# EAGLE design USDA_Project (EAGLE 9.6.2)
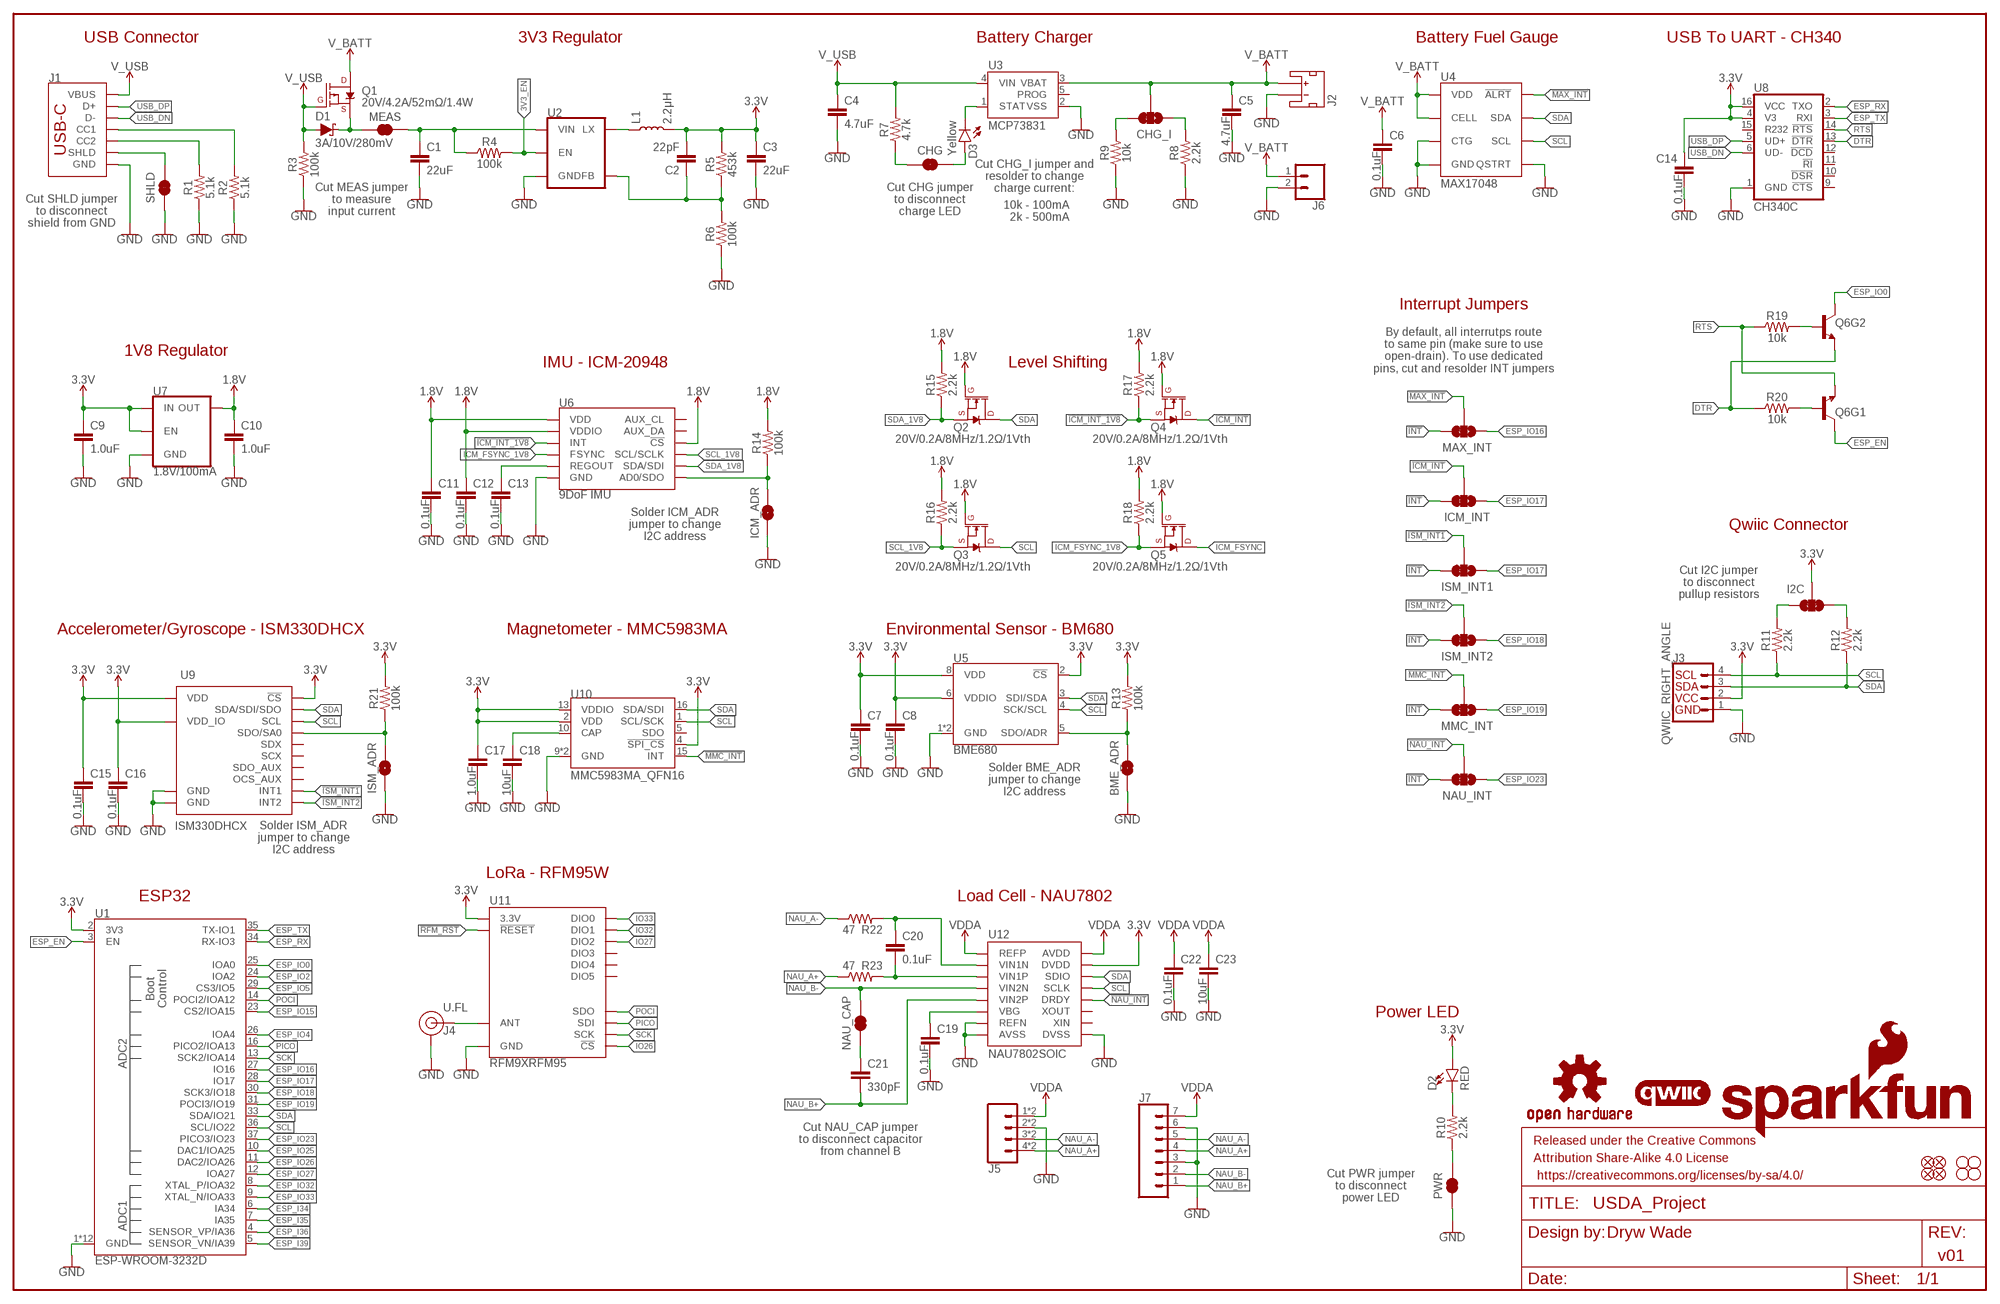
[diagram p0: schematic, sheet 1]

## Parts
BME_ADR  JUMPER-SMT_2_NO_SILK  [SMT-JUMPER_2_NO_SILK]
C1  22uF  22UF-0805-16V-20%  [0805]
C2  22pF  22PF-0603-50V-5%  [0603]
C3  22uF  22UF-0805-16V-20%  [0805]
C4  4.7uF  4.7UF-0603-6.3V-(10%)  [0603]
C5  4.7uF  4.7UF-0603-6.3V-(10%)  [0603]
C6  0.1uF  0.1UF-0603-25V-(+80/-20%)  [0603]
C7  0.1uF  0.1UF-0603-25V-(+80/-20%)  [0603]
C8  0.1uF  0.1UF-0603-25V-(+80/-20%)  [0603]
C9  1.0uF  1.0UF-0603-16V-10%  [0603]
C10  1.0uF  1.0UF-0603-16V-10%  [0603]
C11  0.1uF  0.1UF-0603-25V-(+80/-20%)  [0603]
C12  0.1uF  0.1UF-0603-25V-(+80/-20%)  [0603]
C13  0.1uF  0.1UF-0603-25V-(+80/-20%)  [0603]
C14  0.1uF  0.1UF-0603-25V-(+80/-20%)  [0603]
C15  0.1uF  0.1UF-0603-25V-(+80/-20%)  [0603]
C16  0.1uF  0.1UF-0603-25V-(+80/-20%)  [0603]
C17  1.0uF  1.0UF-0603-16V-10%  [0603]
C18  10uF  10UF-0603-6.3V-20%  [0603]
C19  0.1uF  0.1UF-0603-25V-(+80/-20%)  [0603]
C20  0.1uF  0.1UF-0603-25V-(+80/-20%)  [0603]
C21  330pF  330PF-0603-50V-5%  [0603]
C22  0.1uF  0.1UF-0603-25V-(+80/-20%)  [0603]
C23  10uF  10UF-0603-6.3V-20%  [0603]
CHG  JUMPER-SMT_2_NC_TRACE_SILK  [SMT-JUMPER_2_NC_TRACE_SILK]
CHG_I  JUMPER-SMT_3_1-NC_TRACE_SILK  [SMT-JUMPER_3_1-NC_TRACE_SILK]
D1  3A/10V/280mV  DIODE-SCHOTTKY-BAT60A  [SOD-323]
D2  RED  LED-RED0603  [LED-0603]
D3  Yellow  LED-YELLOW0603  [LED-0603]
FD1  FIDUCIAL1X2  [FIDUCIAL-1X2]
FD2  FIDUCIAL1X2  [FIDUCIAL-1X2]
FD3  FIDUCIAL1X2  [FIDUCIAL-1X2]
FD4  FIDUCIAL1X2  [FIDUCIAL-1X2]
FRAME1  FRAME-LEDGER  [CREATIVE_COMMONS]
H1  STAND-OFF  [STAND-OFF]
H2  STAND-OFF  [STAND-OFF]
H3  STAND-OFF  [STAND-OFF]
H4  STAND-OFF  [STAND-OFF]
I2C  JUMPER-SMT_3_2-NC_TRACE_SILK  [SMT-JUMPER_3_2-NC_TRACE_SILK]
ICM_ADR  JUMPER-SMT_2_NO_SILK  [SMT-JUMPER_2_NO_SILK]
ICM_INT  JUMPER-SMT_3_1-NC_TRACE_SILK  [SMT-JUMPER_3_1-NC_TRACE_SILK]
ISM_ADR  JUMPER-SMT_2_NO_SILK  [SMT-JUMPER_2_NO_SILK]
ISM_INT1  JUMPER-SMT_3_1-NC_TRACE_SILK  [SMT-JUMPER_3_1-NC_TRACE_SILK]
ISM_INT2  JUMPER-SMT_3_1-NC_TRACE_SILK  [SMT-JUMPER_3_1-NC_TRACE_SILK]
J1  USB_C_2-LAYER_PADS  [USB-C-16P-2LAYER-PADS]
J2  JST_2MM_MALE  [JST-2-SMD]
J3  QWIIC_RIGHT_ANGLE  QWIIC_CONNECTORJS-1MM  [JST04_1MM_RA]
J4  U.FL  U.FL2PIN  [U.FL]
J5  CONN_04SPRING  [1X04_SPRING_TERMINAL]
J6  CONN_021X02_NO_SILK  [1X02_NO_SILK]
J7  CONN_07NO_SILK  [1X07_NO_SILK]
L1  2.2μH  2.2μH-4X4-2.2μH-3A-45MOHM  [INDUCTOR_4X4MM]
LOGO1  SFE_LOGO_NAME_FLAME.1_INCH  [SFE_LOGO_NAME_FLAME_.1]
LOGO2  OSHW-LOGOS  [OSHW-LOGO-S]
LOGO3  QWIIC_LOGO_5MM  [QWIIC_5MM]
MAX_INT  JUMPER-SMT_3_1-NC_TRACE_SILK  [SMT-JUMPER_3_1-NC_TRACE_SILK]
MEAS  JUMPER-COMBO_2_NC_TRACE  [COMBO-JUMPER_2_NC_TRACE]
MMC_INT  JUMPER-SMT_3_1-NC_TRACE_SILK  [SMT-JUMPER_3_1-NC_TRACE_SILK]
NAU_CAP  JUMPER-SMT_2_NC_TRACE_SILK  [SMT-JUMPER_2_NC_TRACE_SILK]
NAU_INT  JUMPER-SMT_3_1-NC_TRACE_SILK  [SMT-JUMPER_3_1-NC_TRACE_SILK]
PWR  JUMPER-SMT_2_NC_TRACE_SILK  [SMT-JUMPER_2_NC_TRACE_SILK]
Q1  20V/4.2A/52mΩ/1.4W  MOSFET_PCH-DMG2305UX-7  [SOT23-3]
Q2  20V/0.2A/8MHz/1.2Ω/1Vth  MOSFET-NCH-RE1C002UNTCL  [SOT-416FL]
Q3  20V/0.2A/8MHz/1.2Ω/1Vth  MOSFET-NCH-RE1C002UNTCL  [SOT-416FL]
Q4  20V/0.2A/8MHz/1.2Ω/1Vth  MOSFET-NCH-RE1C002UNTCL  [SOT-416FL]
Q5  20V/0.2A/8MHz/1.2Ω/1Vth  MOSFET-NCH-RE1C002UNTCL  [SOT-416FL]
Q6  TRANS_NPN_DUAL-MBT3904DW1T1  [SC70-6]
R1  5.1k  5.1KOHM5.1KOHM-0603-1/10W-1%  [0603]
R2  5.1k  5.1KOHM5.1KOHM-0603-1/10W-1%  [0603]
R3  100k  100KOHM-0603-1/10W-1%  [0603]
R4  100k  100KOHM-0603-1/10W-1%  [0603]
R5  453k  453KOHM-0603-1/10W-1%  [0603]
R6  100k  100KOHM-0603-1/10W-1%  [0603]
R7  4.7k  4.7KOHM-0603-1/10W-1%  [0603]
R8  2.2k  2.2KOHM-0603-1/10W-1%  [0603]
R9  10k  10KOHM-0603-1/10W-1%  [0603]
R10  2.2k  2.2KOHM-0603-1/10W-1%  [0603]
R11  2.2k  2.2KOHM-0603-1/10W-1%  [0603]
R12  2.2k  2.2KOHM-0603-1/10W-1%  [0603]
R13  100k  100KOHM-0603-1/10W-1%  [0603]
R14  100k  100KOHM-0603-1/10W-1%  [0603]
R15  2.2k  2.2KOHM-0603-1/10W-1%  [0603]
R16  2.2k  2.2KOHM-0603-1/10W-1%  [0603]
R17  2.2k  2.2KOHM-0603-1/10W-1%  [0603]
R18  2.2k  2.2KOHM-0603-1/10W-1%  [0603]
R19  10k  10KOHM-0603-1/10W-1%  [0603]
R20  10k  10KOHM-0603-1/10W-1%  [0603]
R21  100k  100KOHM-0603-1/10W-1%  [0603]
R22  47  47OHM-0603-1/10W-1%  [0603]
R23  47  47OHM-0603-1/10W-1%  [0603]
SHLD  JUMPER-SMT_2_NC_TRACE_SILK  [SMT-JUMPER_2_NC_TRACE_SILK]
U1  ESP-WROOM-3232D  [ESP-WROOM-32D]
U2  AP3429/A  [SOT23-5]
U3  MCP73831  [SOT23-5]
U4  MAX17048  MAX17048DFN8  [DFN-8]
U5  BME680  BME680-LGA  [LGA3.0X3.0]
U6  9DoF IMU  ICM-20948  [QFN24-3X3-ICM-20948]
U7  1.8V/100mA  V_REG_SP6214-1.8V  [SC70]
U8  CH340C  [SO016]
U9  ISM330DHCX  [LGA-14L]
U10  MMC5983MA_QFN16  [LGA-16-3X3MM-4X4PINS]
U11  RFM9XRFM95  [RFM95]
U12  NAU7802SOIC  [SO16]

## Nets
1.8V: C10.1 C11.1 C12.1 Q2.1(G) Q3.1(G) Q4.1(G) Q5.1(G) R14.2 R15.2 R16.2 R17.2 R18.2 U6.8(VDDIO) U6.13(VDD) U6.22(!CS) U7.5(OUT)
3.3V: C2.2 C3.1 C7.1 C8.1 C9.1 C14.1 C15.1 C16.1 C17.1 D2.A I2C.2 J3.2 L1.P$2 R5.2 R13.2 R21.2 U1.2(3V3) U5.2(!CS) U5.6(VDDIO) U5.8(VDD) U7.1(IN) U7.3(EN) U8.4(V3) U8.16(VCC) U9.P5(VDD_IO) U9.P8(VDD) U9.P12(!CS!) U10.2(VDD) U10.4(!SPI_CS!) U10.13(VDDIO) U11.3.3V U12.15(DVDD)
3V3_EN: R4.2 U2.1(EN)
!ICM_INT!: ICM_INT.2 Q4.3(D)
!ICM_INT_1V8!: Q4.2(S) R17.1 U6.12(INT)
!INT!: ICM_INT.3 ISM_INT1.3 ISM_INT2.3 MAX_INT.3 MMC_INT.3 NAU_INT.3
!ISM_INT1!: ISM_INT1.2 U9.P4(INT1)
!ISM_INT2!: ISM_INT2.2 U9.P9(INT2)
!MAX_INT!: MAX_INT.2 U4.5(!ALRT)
!MMC_INT!: MMC_INT.2 U10.15(INT)
!NAU_INT!: NAU_INT.2 U12.12(DRDY)
!RFM_RST!: U11.!RESET
DTR: Q6.1(E) R20.1 U8.13(!DTR)
ESP_EN: Q6.3(C) U1.3(EN)
ESP_I34: U1.6(IA34)
ESP_I35: U1.7(IA35)
ESP_I36: U1.4(SENSOR_VP/IA36)
ESP_I39: U1.5(SENSOR_VN/IA39)
ESP_IO0: Q6.6(C) U1.25(IOA0)
ESP_IO2: U1.24(IOA2)
ESP_IO4: U1.26(IOA4)
ESP_IO5: U1.29(CS3/IO5)
ESP_IO15: U1.23(CS2/IOA15)
ESP_IO16: MAX_INT.1 U1.27(IO16)
ESP_IO17: ICM_INT.1 ISM_INT1.1 U1.28(IO17)
ESP_IO18: ISM_INT2.1 U1.30(SCK3/IO18)
ESP_IO19: MMC_INT.1 U1.31(POCI3/IO19)
ESP_IO23: NAU_INT.1 U1.37(PICO3/IO23)
ESP_IO25: U1.10(DAC1/IOA25)
ESP_IO26: U1.11(DAC2/IOA26)
ESP_IO27: U1.12(IOA27)
ESP_IO32: U1.8(XTAL_P/IOA32)
ESP_IO33: U1.9(XTAL_N/IOA33)
ESP_RX: U1.34(RX-IO3) U8.2(TXO)
ESP_TX: U1.35(TX-IO1) U8.3(RXI)
GND: BME_ADR.1 C1.2 C3.2 C4.2 C5.2 C6.2 C7.2 C8.2 C9.2 C10.2 C11.2 C12.2 C13.2 C14.2 C15.2 C16.2 C17.2 C18.2 C19.2 C22.2 C23.2 ICM_ADR.1 ISM_ADR.1 J1.GND J1.GND2(GND) J2.1(-) J3.1 J4.1(GND) J4.2(GND) J5.2 J5.6 J6.2 J7.3 J7.6 PWR.1 R1.1 R2.1 R3.1 R6.1 R8.1 R9.1 SHLD.1 U1.1(GND) U1.15(GND) U1.38(GND) U1.GND U1.GNDT1(GND) U1.GNDT2(GND) U1.GNDT3(GND) U1.GNDT4(GND) U1.GNDT5(GND) U1.GNDT6(GND) U1.GNDT7(GND) U1.GNDT8(GND) U2.2(GND) U3.2(VSS) U4.1(CTG) U4.4(GND) U4.6(QSTRT) U4.9(GND) U5.1(GND) U5.7(GND) U6.18(GND) U6.20(GND) U7.2(GND) U8.1(GND) U9.P6(GND) U9.P7(GND) U10.9(GND) U10.11(GND) U11.GND@1(GND) U11.GND@2(GND) U11.GND@3(GND) U12.7(REFN) U12.8(AVSS) U12.9(DVSS)
ICM_FSYNC: Q5.3(D)
ICM_FSYNC_1V8: Q5.2(S) R18.1 U6.11(FSYNC)
IO26: U11.NSS(!CS!)
IO27: U11.DIO2
IO32: U11.DIO1
IO33: U11.DIO0
N$1: J1.SHLD1(SHLD) J1.SHLD2(SHLD) J1.SHLD3(SHLD) J1.SHLD4(SHLD) SHLD.2
N$2: L1.P$1 U2.3(LX)
N$3: C1.1 MEAS.2 MEAS.4 R4.1 U2.4(VIN)
N$4: J1.B5(CC2) R1.2
N$5: J1.A5(CC1) R2.2
N$6: D1.C MEAS.1 MEAS.3 Q1.2(S)
N$7: C2.1 R5.1 R6.2 U2.5(FB)
N$8: D3.C U3.1(STAT)
N$9: CHG.2 D3.A
N$10: CHG.1 R7.1
N$11: CHG_I.3 R9.2
N$12: CHG_I.1 R8.2
N$13: BME_ADR.2 R13.1 U5.5(SDO/ADR)
N$14: C13.1 U6.10(REGOUT)
N$15: I2C.1 R12.2
N$16: I2C.3 R11.2
N$17: ICM_ADR.2 R14.1 U6.9(AD0/SDO)
N$18: Q6.5(B) R20.2
N$19: Q6.2(B) R19.2
N$20: C18.1 U10.10(CAP)
N$21: ISM_ADR.2 R21.1 U9.P1(SDO/SA0)
N$22: C19.1 U12.6(VBG)
N$23: D2.C R10.2
N$24: C21.1 NAU_CAP.1
N$25: J4.FEED(SIGNAL) U11.ANT
N$26: PWR.2 R10.1
N$27: C20.2 R23.2 U12.3(VIN1P)
N$28: C20.1 R22.2 U12.2(VIN1N)
NAU_A+: J5.4 J5.8 J7.4 R23.1
NAU_A-: J5.3 J5.7 J7.5 R22.1
NAU_B+: C21.2 J7.1 U12.5(VIN2P)
NAU_B-: J7.2 NAU_CAP.2 U12.4(VIN2N)
PICO: U1.16(PICO2/IOA13) U11.SDI
POCI: U1.14(POCI2/IOA12) U11.SDO
RTS: Q6.4(E) R19.1 U8.14(!RTS)
SCK: U1.13(SCK2/IOA14) U11.SCK
SCL: J3.4 Q3.3(D) R11.1 U1.36(SCL/IO22) U4.7(SCL) U5.4(SCK/SCL) U9.P13(SCL) U10.1(SCL/SCK) U12.13(SCLK)
SCL_1V8: Q3.2(S) R16.1 U6.23(SCL/SCLK)
SDA: J3.3 Q2.3(D) R12.1 U1.33(SDA/IO21) U4.8(SDA) U5.3(SDI/SDA) U9.P14(SDA/SDI/SDO) U10.16(SDA/SDI) U12.14(SDIO)
SDA_1V8: Q2.2(S) R15.1 U6.24(SDA/SDI)
USB_DN: J1.A7(D-) J1.B7(D-) U8.6(UD-)
USB_DP: J1.A6(D+) J1.B6(D+) U8.5(UD+)
V_BATT: C5.1 C6.1 CHG_I.2 J2.2(+) J6.1 Q1.3(D) U3.3(VBAT) U4.2(CELL) U4.3(VDD)
V_USB: C4.1 D1.A J1.VBUS1(VBUS) J1.VBUS2(VBUS) Q1.1(G) R3.2 R7.2 U3.4(VIN)
VDDA: C22.1 C23.1 J5.1 J5.5 J7.7 U12.1(REFP) U12.16(AVDD)
Unconnected: J2.NC1(PAD1) J2.NC2(PAD2) U3.5(PROG) U6.7(AUX_CL) U6.21(AUX_DA) U8.9(!CTS) U8.10(!DSR) U8.11(!RI) U8.12(!DCD) U8.15(R232) U9.P2(SDX) U9.P3(SCX) U9.P10(OCS_AUX) U9.P11(SDO_AUX) U10.5(SDO) U11.DIO3 U11.DIO4 U11.DIO5 U12.10(XIN) U12.11(XOUT)

## Notes on the sheet
- USB Connector | 3V3 Regulator | Battery Charger | Battery Fuel Gauge | USB To UART - CH340
- Cut CHG_I jumper and
  resolder to change
  charge current:
- Cut MEAS jumper
  to measure
  input current
- Cut CHG jumper
  to disconnect
  charge LED
- Cut SHLD jumper
  to disconnect
  shield from GND
- 10k - 100mA
  2k - 500mA
- Interrupt Jumpers
- 1V8 Regulator
- By default, all interrutps route
  to same pin (make sure to use
  open-drain). To use dedicated
  pins, cut and resolder INT jumpers
- IMU - ICM-20948 | Level Shifting
- Solder ICM_ADR
  jumper to change
  I2C address
- Qwiic Connector
- Cut I2C jumper
  to disconnect
  pullup resistors
- Accelerometer/Gyroscope - ISM330DHCX | Magnetometer - MMC5983MA | Environmental Sensor - BM680
- Solder BME_ADR
  jumper to change
  I2C address
- Solder ISM_ADR
  jumper to change
  I2C address
- LoRa - RFM95W
- ESP32 | Load Cell - NAU7802
- Power LED
- Cut NAU_CAP jumper
  to disconnect capacitor
  from channel B
- Cut PWR jumper
  to disconnect
  power LED
- Dryw Wade
- v01

## Library data of the parts
BME_ADR ICM_ADR ISM_ADR = SparkFun-Jumpers:JUMPER-SMT_2_NO: Normally open jumper This jumper has two pads in close proximity to each other. Apply solder to close the connection. Round pads are easier to solder for beginners, but are a lot larger. SparkFun Product that uses the round pads: SparkFun EL Sequencer <https://www.sparkfun.com/products/12781>
C1 C3 = SparkFun-Capacitors:22UF: 22µF ceramic capacitors A capacitor is a passive two-terminal electrical component used to store electrical energy temporarily in an electric field.; PROD_ID: CAP-14260
C2 = SparkFun-Capacitors:22PF: 22pF ceramic capacitors A capacitor is a passive two-terminal electrical component used to store electrical energy temporarily in an electric field.; PROD_ID: CAP-07876
C4 C5 = SparkFun-Capacitors:4.7UF: 4.7µF ceramic capacitors A capacitor is a passive two-terminal electrical component used to store electrical energy temporarily in an electric field.; PROD_ID: CAP-08280
C6-C8 C11-C16 C19 C20 C22 = SparkFun-Capacitors:0.1UF: 0.1µF ceramic capacitors A capacitor is a passive two-terminal electrical component used to store electrical energy temporarily in an electric field.; PROD_ID: CAP-00810
C9 C10 C17 = SparkFun-Capacitors:1.0UF: 1µF ceramic capacitors A capacitor is a passive two-terminal electrical component used to store electrical energy temporarily in an electric field.; PROD_ID: CAP-00868
C18 C23 = SparkFun-Capacitors:10UF: 10.0µF ceramic capacitors A capacitor is a passive two-terminal electrical component used to store electrical energy temporarily in an electric field.; PROD_ID: CAP-11015
C21 = SparkFun-Capacitors:330PF: 330pF/0.33nF ceramic capacitors A capacitor is a passive two-terminal electrical component used to store electrical energy temporarily in an electric field.; PROD_ID: CAP-10108
CHG NAU_CAP PWR SHLD = SparkFun-Jumpers:JUMPER-SMT_2_NC_TRACE: Normally closed trace jumper This jumper has a trace between two pads so it's normally closed (NC). Use a razor knife to open the connection. For best results follow the IPC guidelines for cutting traces: Cutout at least 0.063 mm (0.005 in). Remove all loose material to clean up the cut area. Seal the cut with an approved epoxy. Reapply solder to reclose the connection.
CHG_I ICM_INT ISM_INT1 ISM_INT2 MAX_INT MMC_INT NAU_INT = SparkFun-Jumpers:JUMPER-SMT_3_1-NC_TRACE: Normally closed trace jumper (1 of 2 connections) This jumper has a trace between two pads so it's normally closed (NC). The other connection is normally open (NO). Use a razor knife to open the connection. For best results follow the IPC guidelines for cutting traces: Cutout at least 0.063 mm (0.005 in). Remove all loose material to clean up the cut area. Seal the cut with an approved epoxy. Reapply solder to reclose the connection, or to close the NO connection.
D1 = SparkFun-DiscreteSemi:DIODE-SCHOTTKY: Schottky diode A Schottky diode is a semiconductor diode which has a low forward voltage drop and a very fast switching action.; PROD_ID: DIO-14072
D2 = SparkFun-LED:LED-RED: Red SMD LED Used in manufacturing of most products at SparkFun Packages: 0603 - SMD 0603 package [Product Link] <http://docs.avagotech.com/docs/AV02-0551EN> 0603 SMART - SMD 0603 SMART package ( more efficient and expensive)[Product Link] <http://www.osram-os.com/Graphics/XPic2/00077099_0.pdf> 1206 - SMD1206 package [Product Link] <https://www.sparkfun.com/datasheets/DevTools/LilyPad/Q150OVS4.pdff> SparkFun Products: Pro Mini 328 -5V <https://www.sparkfun.com/products/821> RedBoard <https://www.sparkfun.com/products/12757> IOIO-OTG <https://www.sparkfun.com/products/13613>; PROD_ID: DIO-00819
D3 = SparkFun-LED:LED-YELLOW: Yellow SMD LED Used in manufacturing several products at SparkFun. Packages: 0603 - SMD 0603 package[Product Link] <http://www.kingbrightusa.com/product.asp?catalog_name=LED&product_id=APT1608SYCK> 0603 -SMART - SMART SMD 0603 package (more efficient/more expensive) [Product Link] <http://www.osram-os.com/osram_os/en/products/product-catalog/led-light-emitting-diodes/smartled-0603/ly-l29k/index.jsp> LilyPad - SMD1206 package[Product Datasheet] <https://www.sparkfun.com/datasheets/DevTools/LilyPad/Q150YUS4.pdf> SparkFun Products: Blynk Board <https://www.sparkfun.com/products/13794> IOIO-OTG <https://www.sparkfun.com/products/13613> XBee Explorer Serial <https://www.sparkfun.com/products/13225>; PROD_ID: DIO-09003
FD1-FD4 = SparkFun-Aesthetics:FIDUCIAL: Fiducial Alignment Points Point-of-reference for pick-and-place machines and other optical instruments.
FRAME1 = SparkFun-Aesthetics:FRAME-LEDGER: Schematic Frame - Ledger Standard 11x14 US Ledger frame
H1-H4 = SparkFun-Hardware:STAND-OFF: Stand Off Drill holes for mechanically mounting via screws, standoffs, etc. Note: Use the keepout ring to avoid running the screw head into surrounding components. Variant Overviews STAND-OFF - Mechanical footprint for a #4 phillips button head screw. STAND-OFF-TIGHT - Mechanical footprint for a #4 phillips button head screw, Example SparkFun Products Screw - Phillips Head (1/4", 4-40, 10 pack) <https://www.sparkfun.com/products/10453> (PRT-10453) Screw - Phillips Head (1/2", 4-40, 10 pack) <https://www.sparkfun.com/products/10452> (PRT-10452) Screw - Phillips Head (3/4", 4-40, 10 pack) <https://www.sparkfun.com/products/10451> (PRT-10451) Screw - Phillips Head (1", 4-40, 10 pack) <https://www.sparkfun.com/products/10450> (PRT-10450)
I2C = SparkFun-Jumpers:JUMPER-SMT_3_2-NC_TRACE: Normally closed trace jumper (2 of 2 connections) This jumper has a trace between all three pads so they are normally closed (NC). Use a razor knife to open the connection(s). For best results follow the IPC guidelines for cutting traces: Cutout at least 0.063 mm (0.005 in). Remove all loose material to clean up the cut area. Seal the cut with an approved epoxy. Reapply solder to reclose the connection(s).
J1 = SparkFun-Connectors:USB_C: USB Type C 16Pin Connector Super Speed pins not available on the 16-pin purely SMD connector so this part is best for USB 2.0 implementations. D1 and D2 are tied together enabling D+/- no matter which way the cable is plugged into the connector. The two channel configuration pins (CC1/2) are exposed. These are normally connected to ground via 5.1k resistors but can be reconfigured for high current/high power applications. **4-LAYER BOARD WARNING!!** If designing 4-layer board, make sure to select the variant _4-LAYER-ISOLATED. The linked footprint (USB-C-16-4LAYER-ISOLATED) includes some very necessary cutout polygons in the inner layers (2 and 15). This prevents the PTH mounting shield legs on the USB connector from electrically connecting any other polygons on the inner layers (usually VCC and GND).; PROD_ID: CONN-14122
J2 = SparkFun-Connectors:JST_2MM_MALE: JST 2MM MALE RA CONNECTOR Two pin, compact surface mount connector. Commonly used as a battery input connection point. We really like the solid locking feeling and high current rating on these small connectors. We use these all the time as battery connectors. Mates to single-cell LiPo batteries. Here is the connector we sell at SparkFun: JST Right Angle Connector - White <https://www.sparkfun.com/products/8612> (PRT-08612) Datasheet <http://www.sparkfun.com/datasheets/Prototyping/Connectors/JST-Horizontal.pdf> It was used on these SparkFun products: SparkFun MOSFET Power Controller <https://www.sparkfun.com/products/11214> (PRT-11214) SparkFun Battery Babysitter - LiPo Battery Manager <https://www.sparkfun.com/products/13777> (PRT-13777) And many, many others that required a lipo battery connection.; PROD_ID: CONN-11443; SF_ID: PRT-08612
J3 = SparkFun-Connectors:QWIIC_CONNECTOR: SparkFun I2C Standard Qwiic Connector An SMD 1mm pitch JST connector makes it easy and quick (get it? Qwiic?) to connect I2C devices to each other. The Qwiic system <http://www.sparkfun.com/qwiic> enables fast and solderless connection between popular platforms and various sensors and actuators. We carry 200mm <https://www.sparkfun.com/products/14204>, 100mm <https://www.sparkfun.com/products/14205>, 50mm <https://www.sparkfun.com/products/14206>, and breadboard friendly <https://www.sparkfun.com/products/14207> Qwiic cables. We also offer 10 pcs strips <https://www.sparkfun.com/products/14323> the SMD connectors.; PROD_ID: CONN-13694
J4 = SparkFun-Connectors:U.FL2PIN: SMD Antenna Connector - U.FL 2mm height, 3.0mm x 3.0mm receptacle size. SparkFun Products: SparkFun WiFi Shield - ESP8266 <https://www.sparkfun.com/products/13287> SparkFun ESP8266 Thing <https://www.sparkfun.com/products/13231> SparkFun MiniGen - Pro Mini Signal Generator Shield <https://www.sparkfun.com/products/11420>; PROD_ID: CONN-09193; SF_ID: WRL-09144
J5 = SparkFun-Connectors:CONN_04: Multi connection point. Often used as Generic Header-pin footprint for 0.1 inch spaced/style header connections On any of the 0.1 inch spaced packages, you can populate with these: Break Away Headers - Straight <https://www.sparkfun.com/products/116> (PRT-00116) Break Away Male Headers - Right Angle <https://www.sparkfun.com/products/553> (PRT-00553) Female Headers <https://www.sparkfun.com/products/115> (PRT-00115) Break Away Headers - Machine Pin <https://www.sparkfun.com/products/117> (PRT-00117) Break Away Female Headers - Swiss Machine Pin <https://www.sparkfun.com/products/743> (PRT-00743) For SCREWTERMINALS and SPRING TERMINALS visit here: Screw Terimnals on SparkFun.com <https://www.sparkfun.com/search/results?term=Screw+Terminals> (5mm/3.5mm/2.54mm spacing) This device is also useful as a general connection point to wire up your design to another part of your project. Our various solder wires solder well into these plated through hole pads. Hook-Up Wire - Assortment (Stranded, 22 AWG) <https://www.sparkfun.com/products/11375> (PRT-11375) Hook-Up Wire - Assortment (Solid Core, 22 AWG) <https://www.sparkfun.com/products/11367> (PRT-11367) View the entire wire category on our website here <https://www.sparkfun.com/categories/141> Special notes: Molex polarized connector foot print use with SKU : PRT-08231 with associated crimp pins and housings. 1MM SMD Version SKU: PRT-10208; PROD_ID: CONN-14363; SF_ID: PRT-08075
J6 = SparkFun-Connectors:CONN_02: Multi connection point. Often used as Generic Header-pin footprint for 0.1 inch spaced/style header connections On any of the 0.1 inch spaced packages, you can populate with these: Break Away Headers - Straight <https://www.sparkfun.com/products/116> (PRT-00116) Break Away Male Headers - Right Angle <https://www.sparkfun.com/products/553> (PRT-00553) Female Headers <https://www.sparkfun.com/products/115> (PRT-00115) Break Away Headers - Machine Pin <https://www.sparkfun.com/products/117> (PRT-00117) Break Away Female Headers - Swiss Machine Pin <https://www.sparkfun.com/products/743> (PRT-00743) For SCREWTERMINALS and SPRING TERMINALS visit here: Screw Terimnals on SparkFun.com <https://www.sparkfun.com/search/results?term=Screw+Terminals> (5mm/3.5mm/2.54mm spacing) This device is also useful as a general connection point to wire up your design to another part of your project. Our various solder wires solder well into these plated through hole pads. Hook-Up Wire - Assortment (Stranded, 22 AWG) <https://www.sparkfun.com/products/11375> (PRT-11375) Hook-Up Wire - Assortment (Solid Core, 22 AWG) <https://www.sparkfun.com/products/11367> (PRT-11367) View the entire wire category on our website here <https://www.sparkfun.com/categories/141> Special notes: Molex polarized connector foot print use with: PRT-08233 with associated crimp pins and housings. 2.54_SCREWTERM for use with PRT-10571. 3.5mm Screw Terminal footprints for PRT-08084 5mm Screw Terminal footprints for use with PRT-08432
J7 = SparkFun-Connectors:CONN_07: Multi connection point. Often used as Generic Header-pin footprint for 0.1 inch spaced/style header connections On any of the 0.1 inch spaced packages, you can populate with these: Break Away Headers - Straight <https://www.sparkfun.com/products/116> (PRT-00116) Break Away Male Headers - Right Angle <https://www.sparkfun.com/products/553> (PRT-00553) Female Headers <https://www.sparkfun.com/products/115> (PRT-00115) Break Away Headers - Machine Pin <https://www.sparkfun.com/products/117> (PRT-00117) Break Away Female Headers - Swiss Machine Pin <https://www.sparkfun.com/products/743> (PRT-00743) For SCREWTERMINALS and SPRING TERMINALS visit here: Screw Terimnals on SparkFun.com <https://www.sparkfun.com/search/results?term=Screw+Terminals> (5mm/3.5mm/2.54mm spacing) This device is also useful as a general connection point to wire up your design to another part of your project. Our various solder wires solder well into these plated through hole pads. Hook-Up Wire - Assortment (Stranded, 22 AWG) <https://www.sparkfun.com/products/11375> (PRT-11375) Hook-Up Wire - Assortment (Solid Core, 22 AWG) <https://www.sparkfun.com/products/11367> (PRT-11367) View the entire wire category on our website here <https://www.sparkfun.com/categories/141> Special notes: Molex polarized connector foot print use with SKU : PRT-08231 with associated crimp pins and housings. 1MM SMD Version SKU: PRT-10208 NOTES ON THE VARIANTS LOCK and LOCK_LONGPADS... This footprint was designed to help hold the alignment of a through-hole component (i.e. 6-pin header) while soldering it into place. You may notice that each hole has been shifted either up or down by 0.005 of an inch from it's more standard position (which is a perfectly straight line). This slight alteration caused the pins (the squares in the middle) to touch the edges of the holes. Because they are alternating, it causes a "brace" to hold the component in place. 0.005 has proven to be the perfect amount of "off-center" position when using our standard breakaway headers. Although looks a little odd when you look at the bare footprint, once you have a header in there, the alteration is very hard to notice. Also,if you push a header all the way into place, it is covered up entirely on the bottom side.
L1 = SparkFun-Coils:2.2μH: 2.2μH Inductor Resist changes in electrical current. Basically a coil of wire. SparkFun Products: SparkFun Edge - HX711 <https://www.sparkfun.com/products/15170>; PROD_ID: NDUC-13770
LOGO1 = SparkFun-Aesthetics:SFE_LOGO_NAME_FLAME: SparkFun Font Logo w/ Flame This is the SparkFun full logo. The logo on the schematic will always be the same size; the package variant is the height of the flame part of the logo. Default layer for the logo on the board is tSilk.
LOGO2 = SparkFun-Aesthetics:OSHW-LOGO: Open-Source Hardware (OSHW) Logo This logo indicates the piece of hardware it is found on incorporates a OSHW license and/or adheres to the definition of open source hardware found here: http://freedomdefined.org/OSHW
LOGO3 = SparkFun-Aesthetics:QWIIC_LOGO: Qwiic Logos for placement on schematic and PCB. The 5.5mm silk logo is best for placing next to Qwiic connector.
MEAS = SparkFun-Jumpers:JUMPER-COMBO_2_NC_TRACE
Q1 = SparkFun-DiscreteSemi:MOSFET_PCH: P-channel MOSFETs Voltage controlled devices that allow control of high current outputs. SparkFun Products: SparkFun ESP32 Thing <https://www.sparkfun.com/products/13907> SparkFun ESP8266 Thing <https://www.sparkfun.com/products/13231> SparkFun Pi Servo HAT V2 <https://www.sparkfun.com/products/15316> DMG2305UX-7 (20V/4.2A/SOT23-3); PROD_ID: TRANS-14388
Q2-Q5 = SparkFun-DiscreteSemi:MOSFET-NCH: N-channel MOSFETs Voltage controlled devices that allow control of high current outputs. SparkFun Products: SparkFun OpenScale <https://www.sparkfun.com/products/13261> SparkFun Digital Sandbox <https://www.sparkfun.com/products/12651> SparkFun Monster Moto Shield <https://www.sparkfun.com/products/10182> SparkFun MOSFET Power Controller <https://www.sparkfun.com/products/11214>; PROD_ID: TRANS-14399
Q6 = SparkFun-DiscreteSemi:TRANS_NPN_DUAL: Dual NPN Transistors in Single Package The MBT3904W1 puts two general purpose 3904 NPN transistors in a single package. Datasheet <http://www.onsemi.com/pub_link/Collateral/MBT3904DW1T1-D.PDF> SparkFun Products: SparkFun ESP32 Thing <https://www.sparkfun.com/products/13907>; PROD_ID: TRANS-13337
R1 R2 = SparkFun-Resistors:5.1KOHM; PROD_ID: RES-12083
R3 R4 R6 R13 R14 R21 = SparkFun-Resistors:100KOHM: 100kΩ resistor A resistor is a passive two-terminal electrical component that implements electrical resistance as a circuit element. Resistors act to reduce current flow, and, at the same time, act to lower voltage levels within circuits. - Wikipedia; PROD_ID: RES-07828
R5 = SparkFun-Resistors:453KOHM: 453kΩ resistor A resistor is a passive two-terminal electrical component that implements electrical resistance as a circuit element. Resistors act to reduce current flow, and, at the same time, act to lower voltage levels within circuits. - Wikipedia; PROD_ID: RES-14466
R7 = SparkFun-Resistors:4.7KOHM: 4.7kΩ resistor A resistor is a passive two-terminal electrical component that implements electrical resistance as a circuit element. Resistors act to reduce current flow, and, at the same time, act to lower voltage levels within circuits. - Wikipedia; PROD_ID: RES-07857
R8 R10-R12 R15-R18 = SparkFun-Resistors:2.2KOHM: 2.2kΩ resistor A resistor is a passive two-terminal electrical component that implements electrical resistance as a circuit element. Resistors act to reduce current flow, and, at the same time, act to lower voltage levels within circuits. - Wikipedia; PROD_ID: RES-08272
R9 R19 R20 = SparkFun-Resistors:10KOHM: 10kΩ resistor A resistor is a passive two-terminal electrical component that implements electrical resistance as a circuit element. Resistors act to reduce current flow, and, at the same time, act to lower voltage levels within circuits. - Wikipedia; PROD_ID: RES-00824
R22 R23 = SparkFun-Resistors:47OHM: 47Ω resistor A resistor is a passive two-terminal electrical component that implements electrical resistance as a circuit element. Resistors act to reduce current flow, and, at the same time, act to lower voltage levels within circuits. - Wikipedia; PROD_ID: RES-14282
U1 = SparkFun-RF:ESP-WROOM-32: ESP-WROOM-32D - trace antenna (includes keepout) ESP-WROOM-32U - U.FL antenna connector Includes both "standard" footprints and "narrow" version (for use with tighter layouts).; PROD_ID: IC-15676
U2 = SparkFun-IC-Power:AP3429/A: AP3429A DC adjustable buck up to 2A output. Auto cut-off at 2.7V makes this a good option for LiPo and other battery powered circuits.; PROD_ID: IC-14465
U3 = SparkFun-IC-Power:MCP73831: MCP73831T Li-Ion, Li-Pol Controller Miniature single cell, fully integrated Li-Ion, Li-polymer charge management controller Datasheet <http://ww1.microchip.com/downloads/en/DeviceDoc/20001984g.pdf> SparkFun Products: SparkFun ESP32 Thing <https://www.sparkfun.com/products/13907> SparkFun 9DoF Razor IMU M0 <https://www.sparkfun.com/products/14001>; PROD_ID: IC-09995
U4 = SparkFun-IC-Power:MAX17048: Micropower 1-Cell Li+ ModelGauge SparkFun Products Qduino Mini <https://www.sparkfun.com/products/13614> (DEV-13614); PROD_ID: IC-12551
U5 = SparkFun-Sensors:BME680: Bosch BME680 – Combined Humidity and Pressure Sensor The BME680 is as combined digital humidity, pressure and temperature sensor based on proven sensing principles. The sensor module is housed in an extremely compact metal-lid LGA package with a footprint of only 3.0×3.0mm with a height of 0.93mm. Its small dimensions and its low power consumption allow the implementation in battery driven devices such as handsets, GPS modules or watches.; PROD_ID: IC-14656
U6 = SparkFun-Sensors:ICM-20948: ICM-20948 9 Degree of Freedom IMU World’s lowest power 9-axis MotionTracking device that is ideally suited for smartphones, tablets, wearable sensors, and IoT applications. Includes onboard Digital Motion Processor to offload computations from the host processor Datasheet <https://cdn.sparkfun.com/assets/learn_tutorials/5/5/0/MPU9250REV1.0.pdf> SparkFun Products: SparkFun IMU Breakout - ICM-20948 <https://www.sparkfun.com/products/15182>; PROD_ID: IC-14247
U7 = SparkFun-IC-Power:V_REG_SP6214: Voltage Regulator - SP6214 SP6214 Series SC-70-5 Micropower SC-70 100 mA CMOS LDO Regulator Datasheet <https://www.exar.com/content/document.ashx?id=654> SparkFun Products: MP3 Trigger <https://www.sparkfun.com/products/13720> SparkFun Particle Sensor Breakout <https://www.sparkfun.com/products/14045>; PROD_ID: VREG-08428
U8 = SparkFun-IC-Comms:CH340C; PROD_ID: IC-14038
U9 = SparkFun-Sensors:ISM330DHCX: ISM330DHCX 6DoF The ISM330DHCX is a system-in-package featuring a high-performance 3D digital accelerometer and 3D digital gyroscope tailored for Industry 4.0 applications.; PROD_ID: IC-16693
U10 = SparkFun-Sensors:MMC5983MA: High Performance 3-axis Magnetic Sensor The MMC5983MA is an AEC-Q100 qualified complete 3-axis magnetic sensor with on-chip signal processing and integrated I2C/SPI bus suitable for use in automotive applications. The device can be connected directly to a microprocessor, eliminating the need for A/D converters or timing resources. It can measure magnetic fields within the full scale range of ±8 Gauss (G), with 0.25mG/0.0625mG per LSB resolution at 16bits/18bits operation mode and 0.4 mG total RMS noise level, enabling heading accuracy of ±0.5° in electronic compass applications.; PROD_ID: IC-16314
U11 = SparkFun-RF:RFM9X: RFM95/96/97/98 The RFM95/96/97/98(W) transceivers feature the LoRaTM long range modem that provides ultra-long range spread spectrum communication and high interference immunity whilst minimising current consumption. These devices also support high performance (G)FSK modes for systems including WMBus, IEEE802.15.4g. The RFM95/96/97/98(W) deliver exceptional phase noise, selectivity, receiver linearity and IIP3 for significantly lower current consumption than competing devices Datasheet <http://www.hoperf.com/upload/rf/RFM95_96_97_98W.pdf>; PROD_ID: IC-13959
U12 = SparkFun-IC-Conversion:NAU7802: 24-bit load cell conversion IC with I2C interface in SOIC-16 package. Similar to HX711 but with true I2C interface.; PROD_ID: IC-14299

## Board
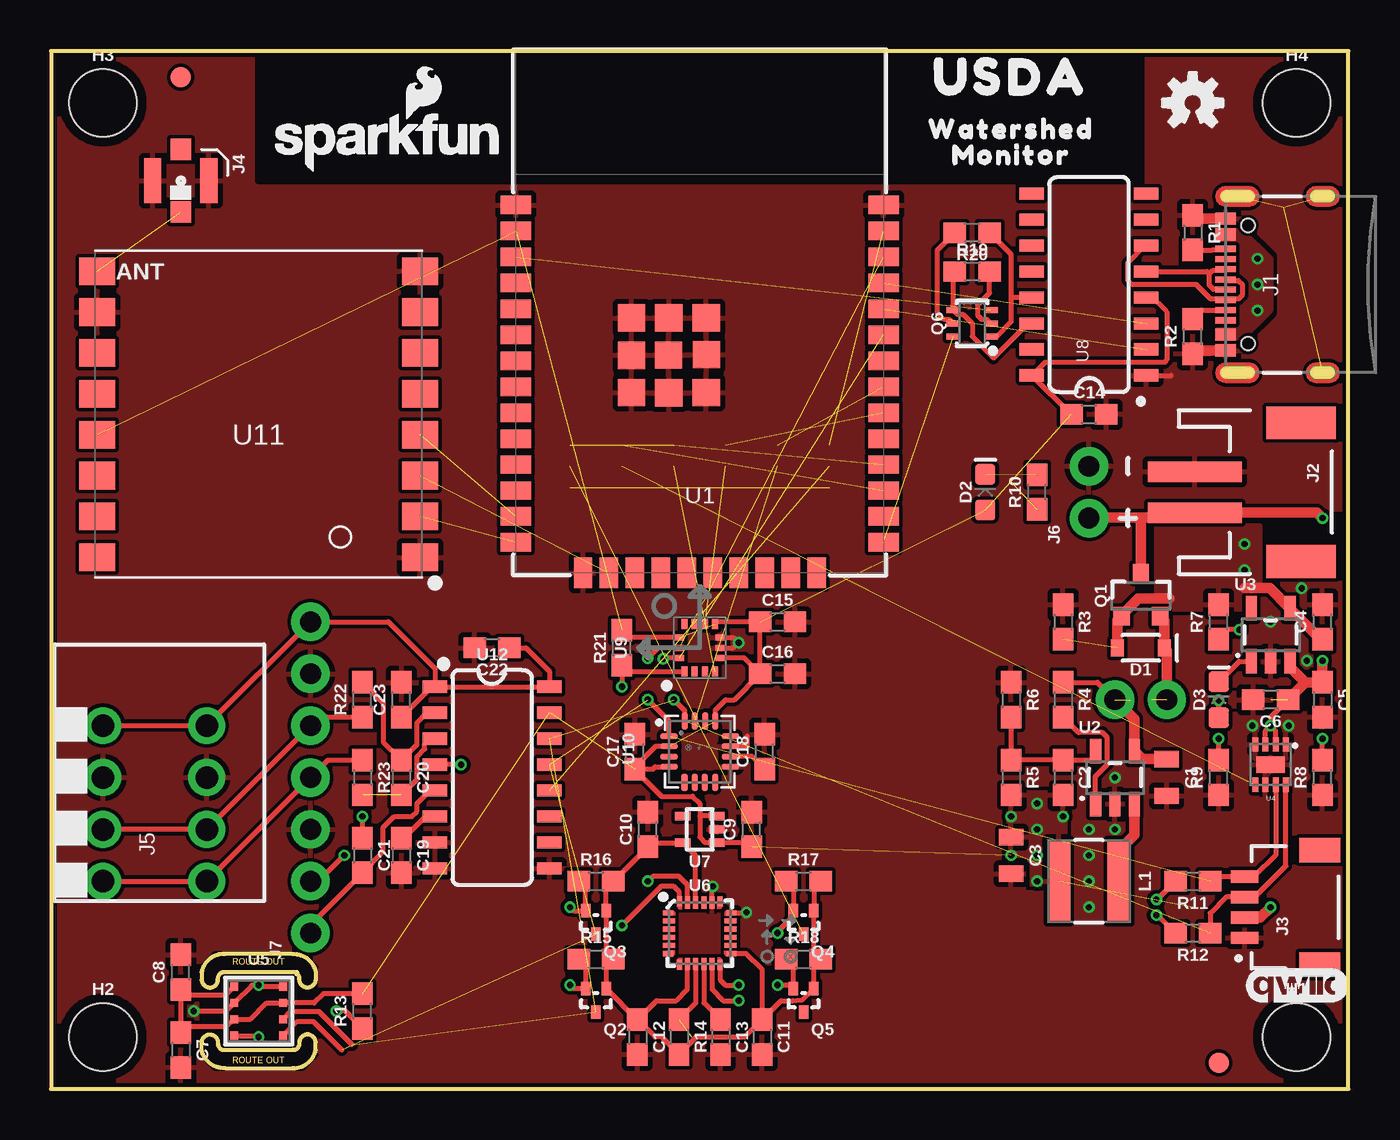
[diagram p1: board, top side]
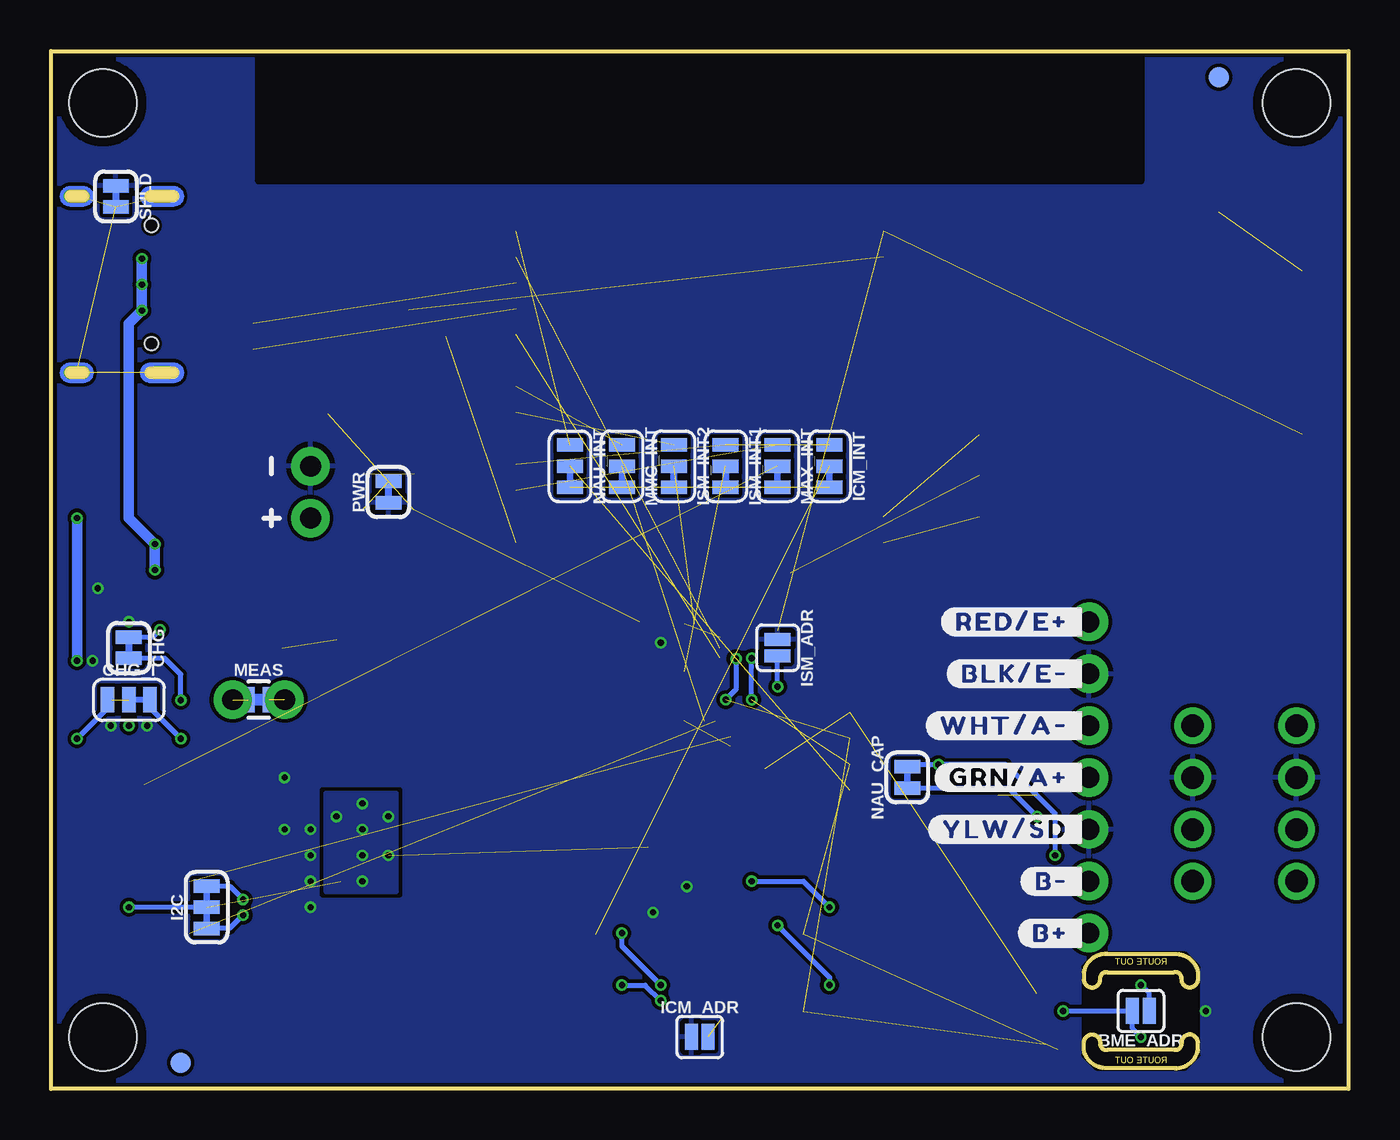
[diagram p2: board, bottom side, seen from below]

Size 63.5 x 50.8 mm. Coordinates in mm from the lower left corner, seen from the top.
Outline: 0,0 63.5,0 63.5,50.8 0,50.8 0,0
Copper layers (1*16): Top 0.035mm / dielectric 1.5mm / Bottom 0.035mm
Design rules "SparkFun-2-Layer-Minimum-JLCPCB": minimum track width 5mil, minimum drill 0.3mm, track to track 5mil, track to pad 5mil, pad to pad 5mil, via to via 5mil, smd to smd 5mil, copper to edge 7mil, drill to drill 7mil, minimum pad ring 5mil, minimum via ring 5mil, stop-mask expansion 2.5mil, vias tented up to drill 25mil, thermal gap 10mil
tRestrict: area 10.2,44.5 to 53.3,50.8; area 62.7,27.8 to 63.2,28.1
bRestrict: area 10.2,44.5 to 53.3,50.8
Milling: 44 lines

### Footprints (pad centres in the part's own frame; a part is rotated, then mirrored left to right if it is on the bottom)
SMT-JUMPER_2_NO_SILK = smd 0.635 x 1.27: 1 -0.406,0; 2 0.406,0
0805 = smd 0.8 x 1.2: 1 -0.9,0; 2 0.9,0
0603 = smd 1.1 x 1: 1 -0.85,0; 2 0.85,0
SMT-JUMPER_2_NC_TRACE_SILK = smd 0.66 x 1.27: 1 -0.521,0; 2 0.521,0
SMT-JUMPER_3_1-NC_TRACE_SILK = smd 0.66 x 1.27: 1 -1.041,0; 2 0,0; 3 1.041,0
SOD-323 = smd 0.63 x 0.83: A 1.15,0; C -1.15,0
LED-0603 = smd 1 x 1: A -0.877,0; C 0.877,0
FIDUCIAL-1X2 = smd 1 x 1: 1 0,0
STAND-OFF = hole 3.302: 0,0
SMT-JUMPER_3_2-NC_TRACE_SILK = smd 0.66 x 1.27: 1 -1.041,0; 2 0,0; 3 1.041,0
USB-C-16P-2LAYER-PADS = smd 0.3 x 1: A5 -1.25,-0.34; A6 -0.25,-0.34; A7 0.25,-0.34; A8 1.25,-0.34; B5 1.75,-0.34; B6 0.75,-0.34; B7 -0.75,-0.34; B8 -1.75,-0.34 | smd 0.6 x 1: GND -3.225,-0.34; GND2 3.225,-0.34; VBUS1 -2.45,-0.34; VBUS2 2.45,-0.34 | drill 0.4 pad 0.6 long: SHLD1 -4.318,-0.915; SHLD2 4.318,-0.915; SHLD3 -4.318,-5.095; SHLD4 4.318,-5.095 | hole 0.65: -2.89,-1.445; 2.89,-1.445
JST-2-SMD = smd 1 x 4.6: 1 -1,-3.7; 2 1,-3.7 | smd 1.6 x 3.4: NC1 -3.4,1.5; NC2 3.4,1.5
JST04_1MM_RA = smd 0.6 x 1.35: 1 -1.5,0; 2 -0.5,0; 3 0.5,0; 4 1.5,0 | smd 1.2 x 2: NC1 2.8,-3.675; NC2 -2.8,-3.675
U.FL = smd 2.2 x 0.85: 1 0,1.375; 2 0,-1.375 | smd 1.05 x 1: FEED 1.525,0; NC -1.525,0
1X04_SPRING_TERMINAL = drill 1.1 pad 1.8: 1 7.62,2.54; 2 5.08,2.54; 3 2.54,2.54; 4 0,2.54; 5 7.62,-2.54; 6 5.08,-2.54; 7 2.54,-2.54; 8 0,-2.54
1X02_NO_SILK = drill 1.016 pad 1.88: 1 0,0; 2 2.54,0
1X07_NO_SILK = drill 1.016 pad 1.88: 1 0,0; 2 2.54,0; 3 5.08,0; 4 7.62,0; 5 10.16,0; 6 12.7,0; 7 15.24,0
INDUCTOR_4X4MM = smd 4.089 x 1.143: P$1 0,1.473; P$2 0,-1.473
COMBO-JUMPER_2_NC_TRACE = smd 0.635 x 1.27: 1 -0.508,0; 2 0.508,0 | drill 1.016 pad 1.88: 3 -1.27,0; 4 1.27,0
SOT23-3 = smd 0.8 x 0.9: 1 -0.95,-1; 2 0.95,-1; 3 0,1.1
SOT-416FL = smd 0.46 x 0.65: 1 -0.5,-1.1; 2 0.5,-1.1; 3 0,0.05
SC70-6 = smd 0.3 x 0.66: 1 -0.65,-0.92; 2 0,-0.92; 3 0.65,-0.92; 4 0.65,0.92; 5 0,0.92; 6 -0.65,0.92
ESP-WROOM-32D = smd 0.9 x 1.5: 1 6.43,9; 2 5.16,9; 3 3.89,9; 4 2.62,9; 5 1.35,9; 6 0.08,9; 7 -1.19,9; 8 -2.46,9; 9 -3.73,9; 10 -5,9; 11 -6.27,9; 12 -7.54,9; 13 -8.81,9; 14 -10.08,9; 25 -10.08,-9; 26 -8.81,-9; 27 -7.54,-9; 28 -6.27,-9; 29 -5,-9; 30 -3.73,-9; 31 -2.46,-9; 32 -1.19,-9; 33 0.08,-9; 34 1.35,-9; 35 2.62,-9; 36 3.89,-9; 37 5.16,-9; 38 6.43,-9 | smd 1.5 x 0.9: 15 -11.57,5.715; 16 -11.57,4.445; 17 -11.57,3.175; 18 -11.57,1.905; 19 -11.57,0.635; 20 -11.57,-0.635; 21 -11.57,-1.905; 22 -11.57,-3.175; 23 -11.57,-4.445; 24 -11.57,-5.715 | smd 1.33 x 1.33: GND -0.912,1.531; GNDT1 -2.751,3.346; GNDT2 -2.761,1.516; GNDT3 -2.751,-0.314; GNDT4 -0.891,-0.324; GNDT5 0.909,-0.314; GNDT6 0.909,1.516; GNDT7 0.909,3.346; GNDT8 -0.921,3.346
SOT23-5 = smd 0.55 x 1.2: 1 -0.95,-1.3; 2 0,-1.3; 3 0.95,-1.3; 4 0.95,1.3; 5 -0.95,1.3
DFN-8 = smd 0.3 x 0.7: 1 -0.75,-0.99; 2 -0.25,-0.99; 3 0.25,-0.99; 4 0.75,-0.99; 5 0.75,0.99; 6 0.25,0.99; 7 -0.25,0.99; 8 -0.75,0.99 | smd 1.38 x 0.8: 9 0,0
LGA3.0X3.0 = smd 0.4 x 0.4: 1 1.2,1.2; 2 1.2,0.4; 3 1.2,-0.4; 4 1.2,-1.2; 5 -1.2,-1.2; 6 -1.2,-0.4; 7 -1.2,0.4; 8 -1.2,1.2
QFN24-3X3-ICM-20948 = smd 0.495 x 0.25: 1 -1.552,1; 6 -1.552,-1; 13 1.552,-1; 18 1.552,1 | smd 0.6 x 0.25: 2 -1.5,0.6; 3 -1.5,0.2; 4 -1.5,-0.2; 5 -1.5,-0.6; 14 1.5,-0.6; 15 1.5,-0.2; 16 1.5,0.2; 17 1.5,0.6 | smd 0.25 x 0.495: 7 -1,-1.552; 12 1,-1.552; 19 1,1.552; 24 -1,1.552 | smd 0.25 x 0.6: 8 -0.6,-1.5; 9 -0.2,-1.5; 10 0.2,-1.5; 11 0.6,-1.5; 20 0.6,1.5; 21 0.2,1.5; 22 -0.2,1.5; 23 -0.6,1.5
SC70 = smd 0.4 x 0.75: 1 -0.65,-0.825; 2 0,-0.825; 3 0.65,-0.825; 4 0.65,0.825; 5 -0.65,0.825
SO016 = smd 0.6 x 1.2: 1 -4.445,-2.8; 2 -3.175,-2.8; 3 -1.905,-2.8; 4 -0.635,-2.8; 5 0.635,-2.8; 6 1.905,-2.8; 7 3.175,-2.8; 8 4.445,-2.8; 9 4.445,2.8; 10 3.175,2.8; 11 1.905,2.8; 12 0.635,2.8; 13 -0.635,2.8; 14 -1.905,2.8; 15 -3.175,2.8; 16 -4.445,2.8
LGA-14L = smd 0.48 x 0.3: P1 -1.163,0.75; P2 -1.163,0.25; P3 -1.163,-0.25; P4 -1.163,-0.75; P8 1.163,-0.75; P9 1.163,-0.25; P10 1.163,0.25; P11 1.163,0.75 | smd 0.3 x 0.48: P5 -0.5,-1; P6 0,-1; P7 0.5,-1; P12 0.5,1; P13 0,1; P14 -0.5,1
LGA-16-3X3MM-4X4PINS = smd 0.3 x 0.85: 1 0.754,1.498; 2 0.254,1.498; 3 -0.246,1.498; 4 -0.746,1.498; 9 -0.746,-1.506; 10 -0.246,-1.506; 11 0.254,-1.506; 12 0.754,-1.506 | smd 0.85 x 0.3: 5 -1.508,0.746; 6 -1.508,0.246; 7 -1.508,-0.254; 8 -1.508,-0.754; 13 1.496,-0.764; 14 1.496,-0.264; 15 1.496,0.236; 16 1.496,0.736
RFM95 = smd 1.75 x 1.35: 3.3V 7.9,1; !RESET -7.9,-3; ANT 7.9,-7; DIO0 7.9,3; DIO1 7.9,5; DIO2 7.9,7; DIO3 7.9,-3; DIO4 7.9,-1; DIO5 -7.9,-5; GND@1 -7.9,7; GND@2 -7.9,-7; GND@3 7.9,-5; NSS -7.9,-1; SCK -7.9,1; SDI -7.9,3; SDO -7.9,5
SO16 = smd 0.6 x 1.2: 1 -4.445,-2.8; 2 -3.175,-2.8; 3 -1.905,-2.8; 4 -0.635,-2.8; 5 0.635,-2.8; 6 1.905,-2.8; 7 3.175,-2.8; 8 4.445,-2.8; 9 4.445,2.8; 10 3.175,2.8; 11 1.905,2.8; 12 0.635,2.8; 13 -0.635,2.8; 14 -1.905,2.8; 15 -3.175,2.8; 16 -4.445,2.8

### Placement (x,y rotation side)
BME_ADR  10.16,3.81 180 bottom
C1  54.61,15.24 270 top
C2  49.53,15.24 270 top
C3  46.99,11.43 270 top
C4  62.23,22.86 90 top
C5  62.23,19.05 270 top
C6  59.69,19.05 180 top
C7  6.35,1.91 270 top
C8  6.35,5.71 90 top
C9  34.29,12.7 90 top
C10  29.21,12.7 90 top
C11  34.8,2.54 270 top
C12  28.7,2.54 270 top
C13  32.77,2.54 270 top
C14  50.8,33.02 0 top
C15  35.56,22.86 0 top
C16  35.56,20.32 0 top
C17  28.57,16.51 90 top
C18  34.92,16.51 90 top
C19  17.14,11.43 270 top
C20  17.14,15.24 270 top
C21  15.24,11.43 270 top
C22  21.59,21.59 180 top
C23  17.14,19.05 90 top
CHG  59.69,21.59 270 bottom
CHG_I  59.69,19.05 0 bottom
D1  53.34,21.59 180 top
D2  45.72,29.21 90 top
D3  57.15,19.05 90 top
FD1  57.15,1.27 0 bottom
FD2  57.15,1.27 0 top
FD3  6.35,49.53 0 top
FD4  6.35,49.53 0 bottom
FRAME1  8.89,-15.24 0 top  (outside the outline)
H1  60.96,2.54 0 top
H2  2.54,2.54 0 top
H3  2.54,48.26 0 top
H4  60.96,48.26 0 top
I2C  55.88,8.89 90 bottom
ICM_ADR  31.75,2.54 0 bottom
ICM_INT  25.4,30.48 270 bottom
ISM_ADR  27.94,21.59 270 bottom
ISM_INT1  30.48,30.48 270 bottom
ISM_INT2  33.02,30.48 270 bottom
J1  57.15,39.37 90 top
J2  59.69,29.21 270 top
J3  58.42,8.89 90 top
J4  6.35,44.45 270 top
J5  5.08,10.16 90 top
J6  50.8,27.94 90 top
J7  12.7,7.62 90 top
L1  50.8,10.16 270 top
LOGO1  16.51,46.35 0 top
LOGO2  55.88,48.26 0 top
LOGO3  60.96,5.08 0 top
MAX_INT  27.94,30.48 270 bottom
MEAS  53.34,19.05 0 bottom
MMC_INT  35.56,30.48 270 bottom
NAU_CAP  21.59,15.24 90 bottom
NAU_INT  38.1,30.48 270 bottom
PWR  46.99,29.21 90 bottom
Q1  53.34,24.13 0 top
Q2  26.67,3.81 180 top
Q3  26.67,7.62 180 top
Q4  36.83,7.62 180 top
Q5  36.83,3.81 180 top
Q6  45.09,37.47 90 top
R1  55.88,41.91 270 top
R2  55.88,36.83 90 top
R3  49.53,22.86 270 top
R4  49.53,19.05 270 top
R5  46.99,15.24 270 top
R6  46.99,19.05 270 top
R7  57.15,22.86 90 top
R8  62.23,15.24 90 top
R9  57.15,15.24 90 top
R10  48.26,29.21 90 top
R11  55.88,10.16 180 top
R12  55.88,7.62 180 top
R13  15.24,3.81 90 top
R14  30.73,2.54 270 top
R15  26.67,6.35 0 top
R16  26.67,10.16 0 top
R17  36.83,10.16 0 top
R18  36.83,6.35 0 top
R19  45.09,40.01 0 top
R20  45.09,41.91 180 top
R21  27.94,21.59 90 top
R22  15.24,19.05 90 top
R23  15.24,15.24 270 top
SHLD  60.33,43.69 270 bottom
U1  31.75,36.83 90 top
U2  52.07,15.24 0 top
U3  59.69,22.23 0 top
U4  59.69,15.88 180 top
U5  10.16,3.81 0 top
U6  31.75,7.62 0 top
U7  31.75,12.7 90 top
U8  50.8,39.37 90 top
U9  31.75,21.59 90 top
U10  31.75,16.51 90 top
U11  10.16,33.02 180 top
U12  21.59,15.24 270 top
U$1  [USDA0]  46.99,49.53 0 top
U$2  [WATERSHED0]  46.99,46.99 0 top
U$3  [MONITOR0]  46.99,45.72 0 top
U$4  [#RED#E#_#0]  12.7,22.86 0 bottom
U$5  [#BLK#E#_#0]  12.7,20.32 0 bottom
U$6  [#WHT#A#_#0]  12.7,17.78 0 bottom
U$7  [#GRN#A#_#0]  12.7,15.24 0 bottom
U$8  [#YLW#SD_#0]  12.7,12.7 0 bottom
U$10  [#B#_#0]  12.7,7.62 0 bottom
U$11  [#B#_#1]  12.7,10.16 0 bottom

### Tracks (layer width: path | path; a pad name or v marks a point on that pad's centre or on a via)
1.8V
  Top 0.229: 36.32,4.32 36.49,4.32 36.5,4.33 36.75,4.33 Q5.1
  Top 0.254: Q5.1 37.33,6 R18.2 37.33,6.7 Q4.1 37.33,9.81 R17.2 | U6.22 31.55,11.43 U7.5 29.41,12.05 C10.1 R16.2 27.17,9.81 Q3.1 27.17,6.7 R15.2 27.17,6 Q2.1 C12.1 | U6.13 34.02,6.62 34.8,5.84 C11.1 | C12.1 29.55,2.54 29.88,2.54 R14.2 31.58,2.54 33.95,2.54 C11.1 | C11.1 35.73,4.32 36.32,4.32 | C12.1 29.63,4.32 30.61,4.32 31.15,4.86 U6.8
3.3V  (via drill 0.3)  (10 unrouted)
  Top 0.254: C14.1 49.91,33.02 U8.16 48.63,35.56 54.49,35.56 54.61,35.68 54.61,38.04 53.79,38.86 53.73,38.86 U8.4 | U5.8 8.52,4.57 6.64,4.57 C8.1 C7.1 6.62,3.03 8.58,3.03 U5.6 9.76,3.41 10.56,4.21 U5.2 12.88,4.21 13.33,4.66 R13.2 | C16.1 33.94,21.09 U9.P5 | U9.P8 32.61,22.86 C15.1 C16.1 | C9.1 34.09,12.05 U7.1 32.02,12.05 31.75,12.32 31.75,13.35 | U7.3 31.75,13.35 | C17.1 29.46,15.66 29.57,15.76 U10.4 | U10.2 29.59,16.76 28.57,15.75 C17.1 | U10.13 32.51,18.54 33.02,19.05 33.44,19.05 C16.1 | U9.P12 28.29,22.09 R21.2 | C17.1 28.57,15.62 29.87,14.32 31.4,14.32 31.75,13.97 31.75,13.35
  Top 0.508: J3.2 59.19,8.39 v59.69,8.89
  Bottom 0.254: I2C.2 v59.69,8.89
  other vias: 48.26,12.7 48.26,13.97 48.26,11.43 48.26,10.16 46.99,11.43 49.53,13.34 46.99,13.34
  pour Top (isolate 0.305): 46.86,14.48 46.86,11.43 47.88,11.43 47.88,10.03 49.66,10.03 49.66,14.48
  pour Bottom (isolate 0.178): 46.61,14.48 46.61,9.65 50.04,9.65 50.04,14.48
3V3_EN
  Top 0.254: U2.1 51.12,15.31 51.69,15.88 51.69,17.2 51.46,17.44 50.29,17.44 R4.2
!ICM_INT!  (1 unrouted)
!ICM_INT_1V8!  (via drill 0.3)
  Top 0.254: R17.1 36.33,9.81 Q4.2 36.33,8.47 35.56,7.7 v35.56,7.62 | U6.12 32.75,5.35 33.02,5.08 v33.66,5.08
  Bottom 0.254: v33.66,5.08 35.56,6.99 v35.56,7.62
!INT!  (5 unrouted)
!ISM_INT1!  (1 unrouted)
!ISM_INT2!  (1 unrouted)
!MAX_INT!  (1 unrouted)
!MMC_INT!  (1 unrouted)
!NAU_INT!  (1 unrouted)
DTR
  Top 0.254: R20.1 46.99,40.85 46.99,38.98 46.99,38.73 | Q6.1 46.26,36.81 46.99,37.55 46.99,38.73 | U8.13 46.99,38.73
ESP_EN  (1 unrouted)
ESP_IO0  (1 unrouted)
ESP_IO16  (1 unrouted)
ESP_IO17  (2 unrouted)
ESP_IO18  (1 unrouted)
ESP_IO19  (1 unrouted)
ESP_IO23  (1 unrouted)
ESP_RX  (1 unrouted)
ESP_TX  (1 unrouted)
GND  (via drill 0.3)
  Top 0.254: 53.55,34.92 U8.1 54.83,34.92 | 57.33,35.98 J1.GND | 57.33,42.76 J1.GND2 | U5.1 10.23,5.01 v10.16,5.08 9.83,5.08 U5.7 8.56,3.81 v6.99,3.81 | U6.20 32.35,9.87 v32.38,9.91 | U6.18 34.02,8.62 v34.04,8.64 | U10.11 34.08,16.76 34.08,17.27 | U9.P6 33.4,21.59 v33.66,21.84 33.41,22.09 U9.P7
  Top 0.508: J1.GND2 56.05,42.59 R1.1 | J1.GND 56.05,36.15 R2.1
  Bottom 0.254: BME_ADR.1 9.75,4.67 v10.16,5.08
  other vias: 52.07,15.24 50.8,10.16 50.8,11.43 50.8,8.89 50.8,12.7 52.07,12.7 61.21,24.51 59.69,22.86 61.47,20.95 58.8,17.78 60.58,17.78
  pour Top (isolate 0.178, rank 2): 0,0 63.5,0 63.5,50.8 0,50.8
  cutout Top (isolate 0.305): 12.95,5.97 12.32,6.6 8,6.6 7.37,5.97 7.37,1.65 8,1.02 12.32,1.02 12.95,1.65
  pour Bottom (isolate 0.178, rank 2): 63.5,0 0,0 0,50.8 63.5,50.8
GND2
  cutout Bottom (isolate 0.305): 12.95,1.65 12.32,1.02 8,1.02 7.37,1.65 7.37,5.97 8,6.6 12.32,6.6 12.95,5.97
ICM_FSYNC_1V8  (via drill 0.3)
  Top 0.254: R18.1 36.33,6 Q5.2 36.16,5.08 v35.56,5.08 | U6.11 32.35,4.86 32.89,4.32 v33.66,4.32
  Bottom 0.254: v35.56,5.08 34.42,5.08 v33.66,4.32
N$1  (4 unrouted)
N$2
  Top 0.508: U2.3 53.02,12.43 52.27,11.68 L1.P$1
N$3  (1 unrouted)
  Top 0.254: R4.1 51.22,19.9 MEAS.4
  Top 0.508: C1.1 53.42,16.14 U2.4 53.02,18.1 MEAS.4
N$4
  Top 0.254: R1.2 56.85,41.06 56.86,41.08 57.45,41.08 J1.B5
N$5
  Top 0.254: R2.2 56.32,38.12 J1.A5
N$6  (1 unrouted)
  Top 0.508: Q1.2 54.49,22.93 D1.C 54.61,21.47 MEAS.3
N$7
  Top 0.254: U2.5 51.12,16.29 50.92,16.09 C2.1 R5.1 R6.2
N$8
  Top 0.254: D3.C 58.15,20.93 U3.1
N$9  (via drill 0.3)
  Top 0.254: D3.A v57.15,19.02
  Bottom 0.254: v57.15,19.02 57.15,20.29 57.93,21.07 CHG.2
N$10  (via drill 0.3)
  Top 0.254: v58.17,22.48 57.62,22.48 R7.1
  Bottom 0.254: CHG.1 58.53,22.11 v58.17,22.48
N$11  (via drill 0.3)
  Top 0.254: R9.2 v57.15,17.14
  Bottom 0.254: v57.15,17.14 58.65,18.64 CHG_I.3
N$12  (via drill 0.3)
  Top 0.254: R8.2 v62.23,17.14
  Bottom 0.254: v62.23,17.14 60.73,18.64 CHG_I.1
N$13  (via drill 0.3)
  Top 0.254: R13.1 14.39,3.81 v13.97,3.81 | U5.5 10.09,2.61 v10.16,2.54
  Bottom 0.254: v13.97,3.81 BME_ADR.2 10.57,2.95 v10.16,2.54
N$14
  Top 0.254: U6.10 31.95,4.21 C13.1
N$15  (via drill 0.3)
  Top 0.254: R12.2 54.14,8.51 v54.1,8.51
  Bottom 0.254: v54.1,8.51 54.76,7.85 I2C.1
N$16  (via drill 0.3)
  Top 0.254: v54.1,9.27 54.14,9.27 R11.2
  Bottom 0.254: I2C.3 54.76,9.93 v54.1,9.27
N$17  (1 unrouted)
  Top 0.254: U6.9 31.55,4.21 R14.1
N$18
  Top 0.254: Q6.5 43.97,37.66 43.71,37.66 43.38,37.99 43.38,41.05 R20.2
N$19
  Top 0.254: Q6.2 45.81,37.66 45.55,37.66 45.37,37.84 45.37,38.39 45.94,38.96 R19.2
N$20
  Top 0.254: C18.1 34.32,16.26 U10.10
N$21  (via drill 0.3)
  Top 0.254: U9.P1 28.25,20.43 R21.1 v27.94,19.68
  Bottom 0.254: v27.94,19.68 ISM_ADR.2
N$22
  Top 0.254: C19.1 17.27,12.28 18.33,13.34 U12.6
N$23  (1 unrouted)
N$24  (via drill 0.3)
  Top 0.254: C21.1 v15.24,13.34
  Bottom 0.254: v15.24,13.34 16.62,14.72 NAU_CAP.1
N$25  (1 unrouted)
N$26  (1 unrouted)
N$27  (1 unrouted)
  Top 0.254: C20.2 17.91,15.15 17.91,16.26 18.29,16.64 18.29,16.89 18.54,17.14 U12.3
N$28
  Top 0.254: R22.2 16.26,18.88 16.26,16.98 C20.1 17.91,16.85 17.91,17.91 18.41,18.41 U12.2
NAU_A+
  Top 0.254: J5.4 J5.8 J7.4 13.55,16.09 R23.1
NAU_A-
  Top 0.254: J5.3 J5.7 J7.5 13.12,18.2 R22.1
NAU_B+
  Top 0.254: U12.5 18.54,14.61 17.91,13.97 17.91,13.59 17.65,13.34 16.79,13.34 16.26,12.8 16.26,11.6 C21.2 12.7,8.04 J7.1
NAU_B-  (via drill 0.3)
  Top 0.254: v14.35,11.43 13.08,10.16 J7.2 | v20.07,15.88 U12.4
  Bottom 0.254: v14.35,11.43 14.35,13.46 16.76,15.88 v20.07,15.88 21.48,15.88 NAU_CAP.2
PICO  (1 unrouted)
POCI  (1 unrouted)
RTS
  Top 0.254: R19.1 44.16,39.94 Q6.4 44.36,37.92 44.62,37.92 45.09,37.46 45.09,36.82 46.13,35.78 47.81,37.47 U8.14
SCK  (1 unrouted)
SCL  (via drill 0.3)  (5 unrouted)
  Top 0.254: U5.4 12.05,3.3 12.83,3.3 14.22,1.91 | R11.1 56.96,10.39 J3.4 58.9,10.39 59.94,11.43 U4.7 | v29.21,21.08 29.72,21.59 U9.P13 | U10.1 30.25,18.01 v29.21,19.05
  Bottom 0.254: v29.21,19.05 v29.21,21.08
SCL_1V8  (via drill 0.3)
  Top 0.254: R16.1 26.17,9.81 Q3.2 25.57,8.72 v25.4,8.89 | U6.23 31.15,10 30.73,10.41 30.48,10.41 29.97,10.41 29.46,10.41 v29.21,10.16
  Bottom 0.254: v29.21,10.16 26.67,10.16 v25.4,8.89
SDA  (via drill 0.3)  (5 unrouted)
  Top 0.254: U5.3 11.73,3.79 13.11,3.79 14.73,2.16 | R12.1 56.73,8.6 57.52,9.39 J3.3 58.92,9.39 60.44,10.91 U4.8 | U9.P14 30,21.09 v29.97,21.06 | v30.48,19.05 31.01,18.52 U10.16
  Bottom 0.254: v29.97,21.06 29.97,19.56 v30.48,19.05
SDA_1V8  (via drill 0.3)
  Top 0.254: R15.1 26.17,6 Q2.2 25.57,4.91 v25.4,5.08 | U6.24 30.75,9.64 30.48,9.91 29.84,9.91 v27.94,8
  Bottom 0.254: v27.94,8 25.4,5.46 v25.4,5.08
USB_DN
  Top 0.254: J1.A7 57.53,39.58 58.12,39.58 58.3,39.4 58.3,38.84 58.12,38.66 57.53,38.66 J1.B7 57.45,38.66 56.75,38.66 56.05,39.37 52.9,39.37 52.7,39.58 52.7,40.43 53.54,41.27 U8.6
USB_DP
  Top 0.254: 56.69,39.9 56.69,39.34 56.89,39.14 57.47,39.14 J1.A6 | 56.69,39.9 56.86,40.08 57.45,40.08 J1.B6 | U8.5 56.58,40.01 56.69,39.9
V_BATT  (via drill 0.3)  (1 unrouted)
  Top 0.254: U4.3 59.44,17.53 v59.69,17.78 | U4.2 59.94,17.53 v59.69,17.78 | C6.1 59.69,18.2 v59.69,17.78
  Top 0.508: v62.23,20.95 C5.1 61.39,19.9 | C6.1 61.39,19.9 | U3.3 60.64,20.65 61.39,19.9 | v62.23,27.94 61.96,28.21 J2.2 55.74,27.96 53.34,27.96 | J6.1 50.82,27.96 53.34,27.96 | Q1.3 53.34,27.96
  Bottom 0.508: v62.23,27.94 v62.23,20.95
V_USB  (via drill 0.3)  (1 unrouted)
  Top 0.508: C4.1 62.16,22.01 U3.4 59.65,24.51 58.42,24.51 | D1.A 52.19,22.93 Q1.1 52.39,23.18 53.21,24 54.74,24
  Bottom 0.508: v59.05,40.64 v59.05,39.37 v59.05,38.1 59.69,37.47 59.69,27.94 v58.42,26.67 v58.42,25.4
  pour Top (isolate 0.178, no thermals): 57.15,42.04 58.29,42.04 59.69,40.64 59.69,38.1 58.29,36.7 57.15,36.7
  pour Top (isolate 0.178): 54.1,27.56 54.1,23.5 59.18,23.5 59.18,27.56
VDDA
  Top 0.254: J5.1 J5.5 J7.7 16.51,22.86 18.79,20.58 U12.1 | U12.1 U12.16 24.39,20.44 23.24,21.59 C22.1 | C23.1 18.63,19.68 U12.1

### Text on the board
Milling: ROUTE OUT | ROUTE OUT | ROUTE OUT | ROUTE OUT
tDocu: Dryw Wade